# EAGLE design Arm controller Mega (EAGLE 9.4.1)
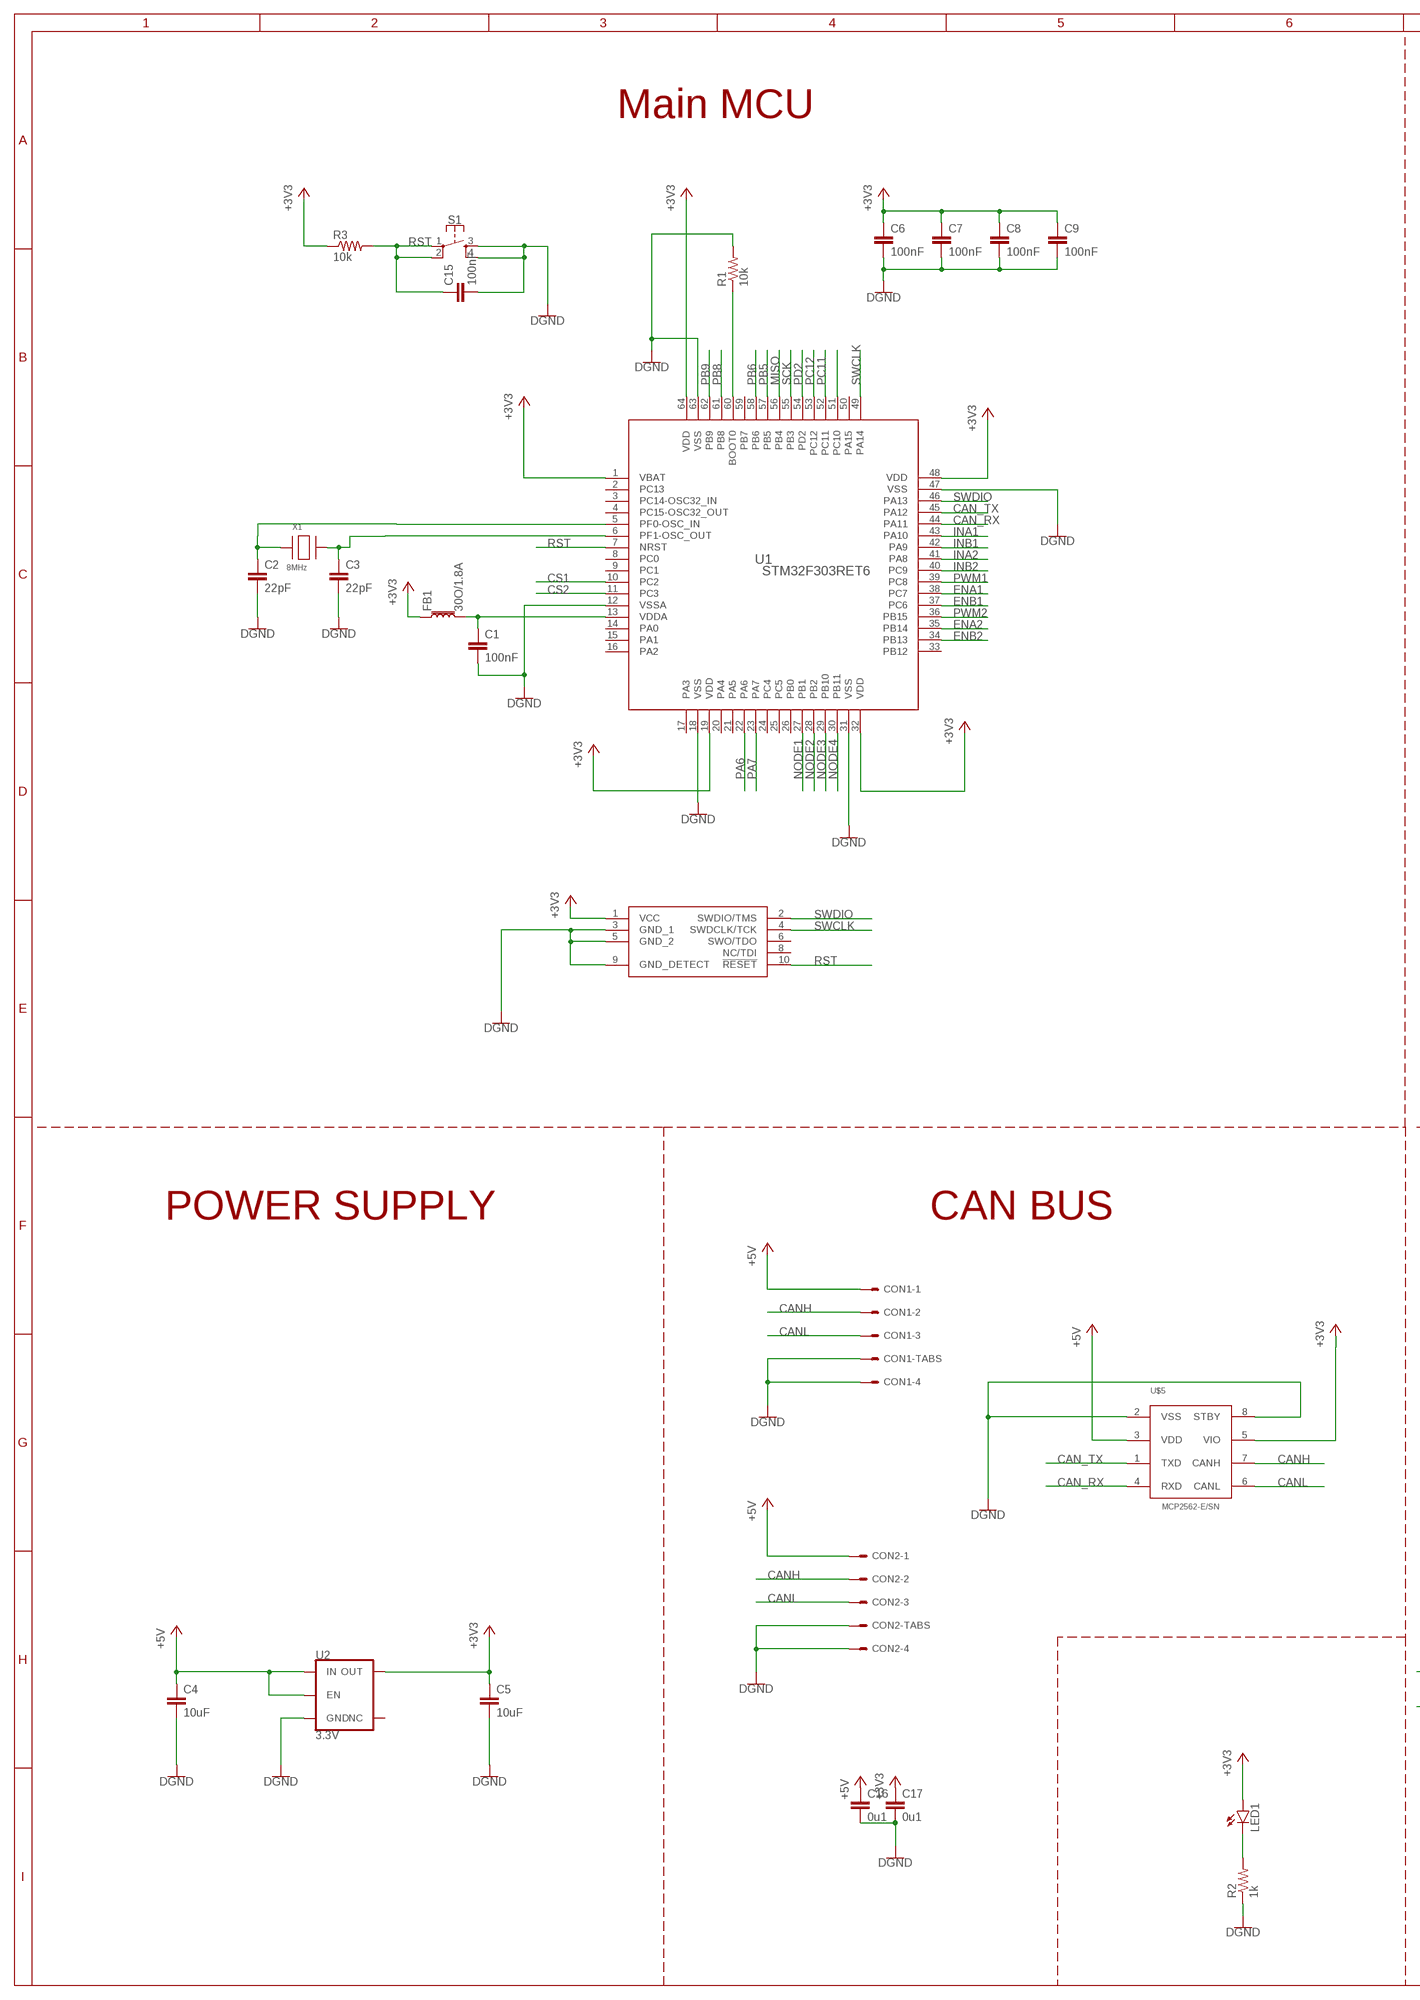
[diagram p0: schematic, sheet 1, part 1 of 2]
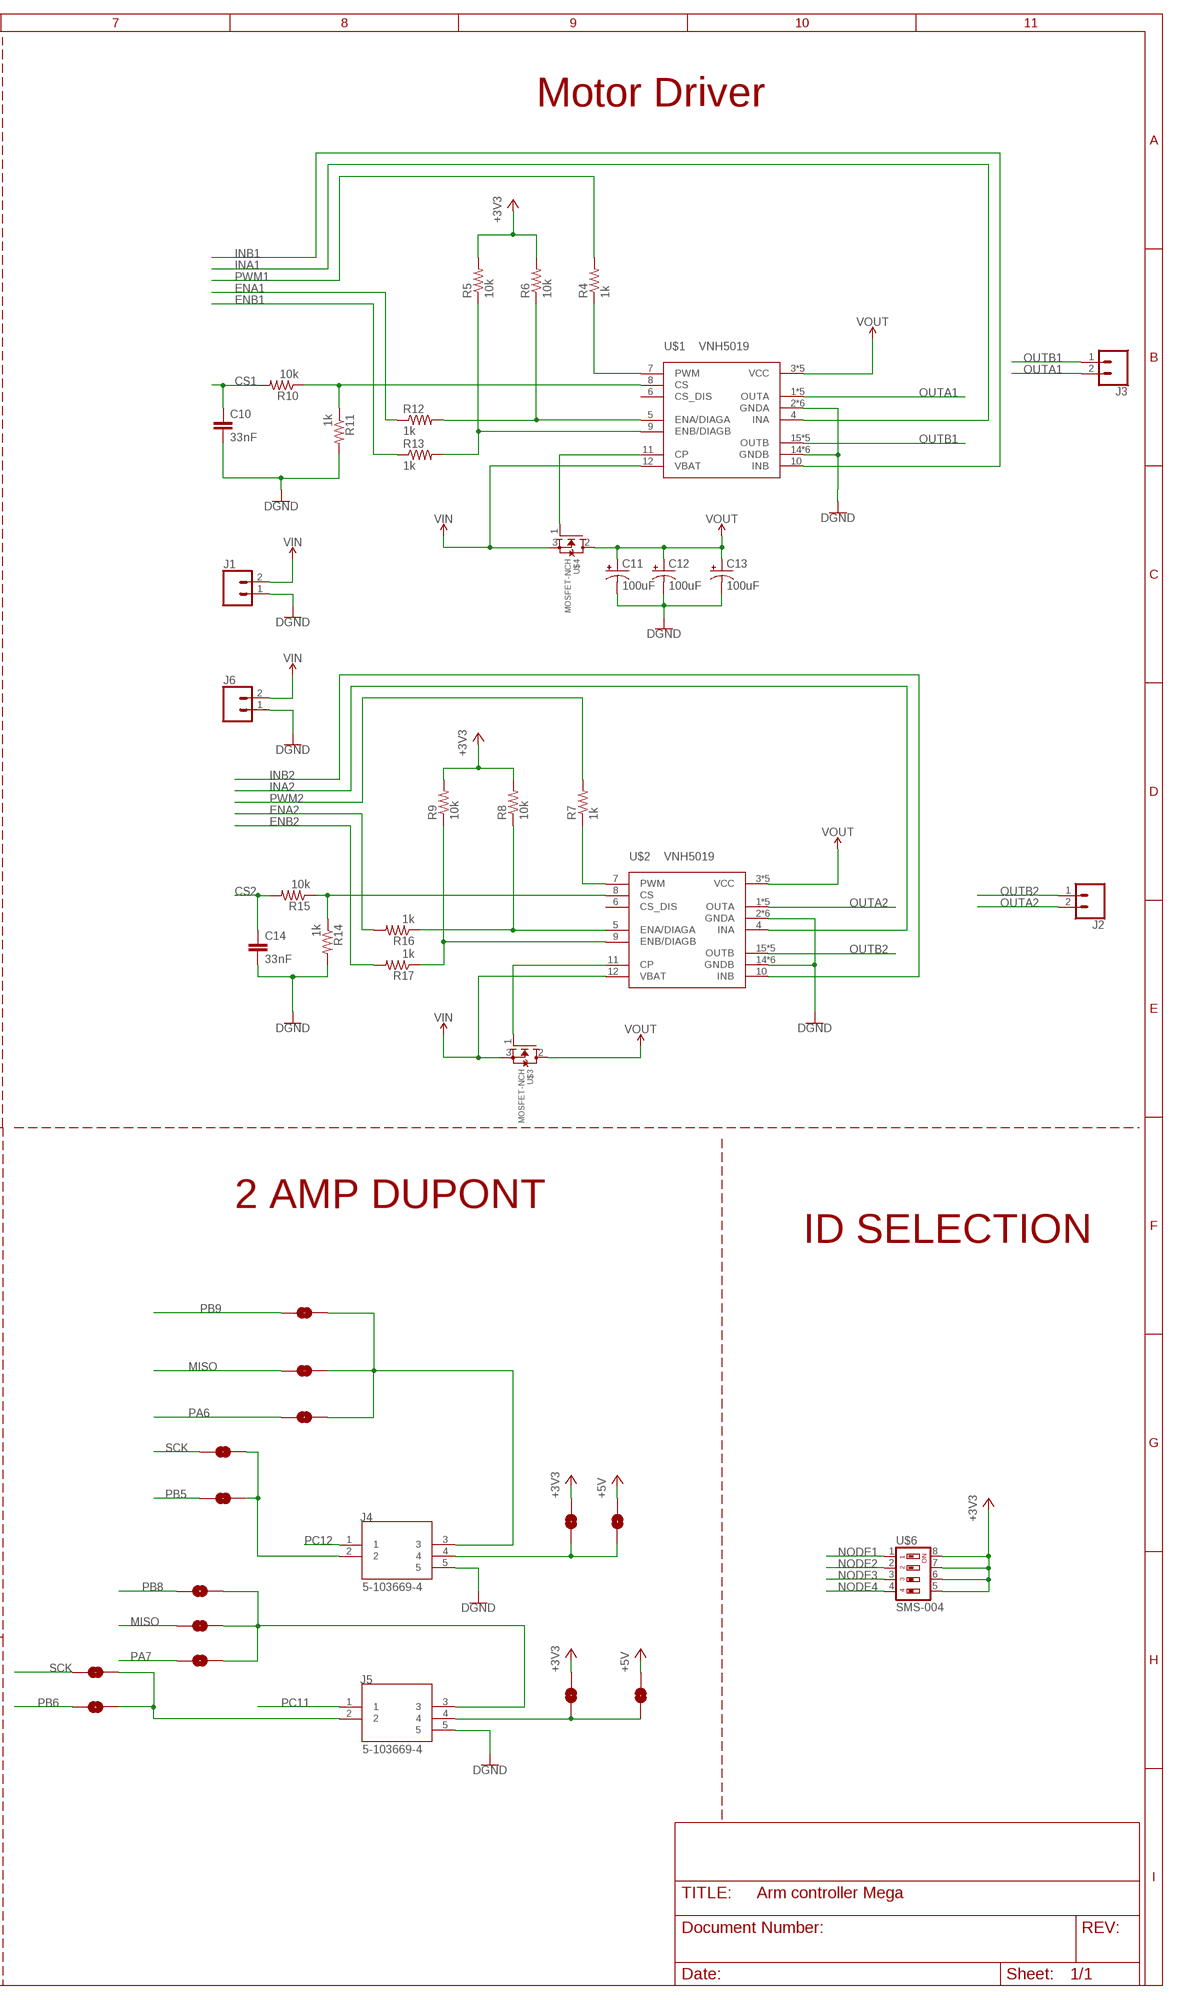
[diagram p1: schematic, sheet 1, part 2 of 2]

## Parts
C1  100nF  C-EUC0805  [C0805]
C2  22pF  C-EUC0805  [C0805]
C3  22pF  C-EUC0805  [C0805]
C4  10uF  C-EUC0805  [C0805]
C5  10uF  C-EUC0805  [C0805]
C6  100nF  C-EUC0805  [C0805]
C7  100nF  C-EUC0805  [C0805]
C8  100nF  C-EUC0805  [C0805]
C9  100nF  C-EUC0805  [C0805]
C10  33nF  C-EUC0805  [C0805]
C11  100uF  CPOL-US153CLV-0810  [153CLV-0810]
C12  100uF  CPOL-US153CLV-0810  [153CLV-0810]
C13  100uF  CPOL-US153CLV-0810  [153CLV-0810]
C14  33nF  C-EUC0805  [C0805]
C15  100nF  C-EUC0805  [C0805]
C16  0u1  C-EUC0805  [C0805]
C17  0u1  C-EUC0805  [C0805]
CON1  SM04B-GHS-TB  [SM04B-GHS-TB]
CON2  SM04B-GHS-TB  [SM04B-GHS-TB]
FB1  30O/1.8A  FERRITE_BEAD-0603  [0603]
J1  CONN_025MM  [SCREWTERMINAL-5MM-2]
J2  CONN_025MM  [SCREWTERMINAL-5MM-2]
J3  CONN_025MM  [SCREWTERMINAL-5MM-2]
J4  5-103669-4  [TE_5-103669-4]
J5  5-103669-4  [TE_5-103669-4]
J6  CONN_025MM  [SCREWTERMINAL-5MM-2]
JP1  CORTEX-M-DBG  [FTSH-105-01-F-DV-007]
JP2  JUMPER-SMT_2_NO_NO-SILK  [SMT-JUMPER_2_NO_NO-SILK]
JP3  JUMPER-SMT_2_NO_NO-SILK  [SMT-JUMPER_2_NO_NO-SILK]
JP4  JUMPER-SMT_2_NO_NO-SILK  [SMT-JUMPER_2_NO_NO-SILK]
JP5  JUMPER-SMT_2_NO_NO-SILK  [SMT-JUMPER_2_NO_NO-SILK]
JP6  JUMPER-SMT_2_NO_NO-SILK  [SMT-JUMPER_2_NO_NO-SILK]
JP7  JUMPER-SMT_2_NO_NO-SILK  [SMT-JUMPER_2_NO_NO-SILK]
JP8  JUMPER-SMT_2_NO_NO-SILK  [SMT-JUMPER_2_NO_NO-SILK]
JP9  JUMPER-SMT_2_NO_NO-SILK  [SMT-JUMPER_2_NO_NO-SILK]
JP10  JUMPER-SMT_2_NO_NO-SILK  [SMT-JUMPER_2_NO_NO-SILK]
JP11  JUMPER-SMT_2_NO_NO-SILK  [SMT-JUMPER_2_NO_NO-SILK]
JP12  JUMPER-SMT_2_NO_NO-SILK  [SMT-JUMPER_2_NO_NO-SILK]
JP13  JUMPER-SMT_2_NO_NO-SILK  [SMT-JUMPER_2_NO_NO-SILK]
JP14  JUMPER-SMT_2_NO_NO-SILK  [SMT-JUMPER_2_NO_NO-SILK]
JP15  JUMPER-SMT_2_NO_NO-SILK  [SMT-JUMPER_2_NO_NO-SILK]
LED1  LEDCHIPLED_0805  [CHIPLED_0805]
R1  10k  R-US_R0805  [R0805]
R2  1k  R-US_R0805  [R0805]
R3  10k  R-US_R0805  [R0805]
R4  1k  R-US_R0805  [R0805]
R5  10k  R-US_R0805  [R0805]
R6  10k  R-US_R0805  [R0805]
R7  1k  R-US_R0805  [R0805]
R8  10k  R-US_R0805  [R0805]
R9  10k  R-US_R0805  [R0805]
R10  10k  R-US_R0805  [R0805]
R11  1k  R-US_R0805  [R0805]
R12  1k  R-US_R0805  [R0805]
R13  1k  R-US_R0805  [R0805]
R14  1k  R-US_R0805  [R0805]
R15  10k  R-US_R0805  [R0805]
R16  1k  R-US_R0805  [R0805]
R17  1k  R-US_R0805  [R0805]
S1  MOMENTARY-SWITCH-SPST-2-SMD-5.2MM  [TACTILE_SWITCH_SMD_5.2MM]
U1  STM32F303RET6  [LQFP64-10X10MM]
U2  3.3V  V_REG_AP2112K-3.3V  [SOT23-5]
U$1  VNH5019  [MULTIPOWERSO-30]
U$2  VNH5019  [MULTIPOWERSO-30]
U$3  MOSFET-NCH  [TO252-3]
U$4  MOSFET-NCH  [TO252-3]
U$5  MCP2562-E/SN  [SOIC8]
U$6  SMS-004  [SMS-004]
X1  8MHz  XTALNX5032  [NX5032]

## Nets
+3V3: C5.1 C6.1 C7.1 C8.1 C9.1 C17.1 FB1.1 JP1.1(VCC) JP2.2 JP4.2 LED1.A R3.1 R5.2 R6.2 R8.2 R9.2 U1.1(VBAT) U1.19(VDD) U1.32(VDD) U1.48(VDD) U1.64(VDD) U2.5(OUT) U$5.5(VIO) U$6.5 U$6.6 U$6.7 U$6.8
+5V: C4.1 C16.1 CON1.P$1 CON2.P$1 JP3.2 JP6.2 U2.1(IN) U2.3(EN) U$5.3(VDD)
CAN_RX: U1.44(PA11) U$5.4(RXD)
CAN_TX: U1.45(PA12) U$5.1(TXD)
CANH: CON1.P$2 CON2.P$2 U$5.7(CANH)
CANL: CON1.P$3 CON2.P$3 U$5.6(CANL)
CS1: C10.1 R10.2 U1.10(PC2)
CS2: C14.1 R15.2 U1.11(PC3)
ENA1: R12.1 U1.38(PC7)
ENA2: R16.2 U1.35(PB14)
ENB1: R13.1 U1.37(PC6)
ENB2: R17.2 U1.34(PB13)
GND: C1.2 C2.2 C3.2 C4.2 C5.2 C6.2 C7.2 C8.2 C9.2 C10.2 C11.- C12.- C13.- C14.2 C15.2 C16.2 C17.2 CON1.P$4 CON1.P$5 CON1.P$6 CON2.P$4 CON2.P$5 CON2.P$6 J1.1 J4.5 J5.5 J6.1 JP1.3(GND_1) JP1.5(GND_2) JP1.9(GND_DETECT) R1.2 R2.1 R11.2 R14.2 S1.3 S1.4 U1.12(VSSA) U1.18(VSS) U1.31(VSS) U1.47(VSS) U1.63(VSS) U2.2(GND) U$1.2(GNDA) U$1.14(GNDB) U$1.17(GNDB) U$1.18(GNDB) U$1.19(GNDB) U$1.20(GNDB) U$1.22(GNDA) U$1.24(GNDB) U$1.26(GNDA) U$1.27(GNDA) U$1.28(GNDA) U$1.29(GNDA) U$2.2(GNDA) U$2.14(GNDB) U$2.17(GNDB) U$2.18(GNDB) U$2.19(GNDB) U$2.20(GNDB) U$2.22(GNDA) U$2.24(GNDB) U$2.26(GNDA) U$2.27(GNDA) U$2.28(GNDA) U$2.29(GNDA) U$5.2(VSS) U$5.8(STBY) ; supply symbol labelled DGND
INA1: U1.43(PA10) U$1.4(INA)
INA2: U1.41(PA8) U$2.4(INA)
INB1: U1.42(PA9) U$1.10(INB)
INB2: U1.40(PC9) U$2.10(INB)
MISO: JP5.2 JP12.2 U1.56(PB4)
N$1: C1.1 FB1.2 U1.13(VDDA)
N$2: C2.1 U1.5(PF0-OSC_IN) X1.P$1
N$3: R1.1 U1.60(BOOT0)
N$4: J5.4 JP2.1 JP3.1
N$6: LED1.C R2.2
N$7: R7.1 U$2.7(PWM)
N$8: R10.1 R11.1 U$1.8(CS)
N$9: R4.1 U$1.7(PWM)
N$10: R6.1 R12.2 U$1.5(ENA/DIAGA)
N$11: R5.1 R13.2 U$1.9(ENB/DIAGB)
N$12: R8.1 R16.1 U$2.5(ENA/DIAGA)
N$13: R9.1 R17.1 U$2.9(ENB/DIAGB)
N$14: R14.1 R15.1 U$2.8(CS)
N$15: U$1.11(CP) U$4.1(G)
N$16: C3.1 U1.6(PF1-OSC_OUT) X1.P$2
N$17: U$2.11(CP) U$3.1(G)
N$18: J4.4 JP4.1 JP6.1
N$19: J4.2 JP9.1 JP10.1
N$21: J4.3 JP5.1 JP7.1 JP8.1
N$23: J5.3 JP11.1 JP12.1 JP13.1
N$24: J5.2 JP14.1 JP15.1
N$28: U1.51(PC10)
NODE1: U1.27(PB1) U$6.1
NODE2: U1.28(PB2) U$6.2
NODE3: U1.29(PB10) U$6.3
NODE4: U1.30(PB11) U$6.4
OUTA1: J3.2 U$1.1(OUTA) U$1.25(OUTA) U$1.30(OUTA) U$1.OUTA U$1.OUTA@1(OUTA)
OUTA2: J2.2 U$2.1(OUTA) U$2.25(OUTA) U$2.30(OUTA) U$2.OUTA U$2.OUTA@1(OUTA)
OUTB1: J3.1 U$1.15(OUTB) U$1.16(OUTB) U$1.21(OUTB) U$1.OUTB U$1.OUTB@1(OUTB)
OUTB2: J2.1 U$2.15(OUTB) U$2.16(OUTB) U$2.21(OUTB) U$2.OUTB U$2.OUTB@1(OUTB)
PA6: JP7.2 U1.22(PA6)
PA7: JP13.2 U1.23(PA7)
PB5: JP9.2 U1.57(PB5)
PB6: JP14.2 U1.58(PB6)
PB8: JP11.2 U1.61(PB8)
PB9: JP8.2 U1.62(PB9)
PC11: J5.1 U1.52(PC11)
PC12: J4.1 U1.53(PC12)
PD2: U1.54(PD2)
PWM1: R4.2 U1.39(PC8)
PWM2: R7.2 U1.36(PB15)
RST: C15.1 JP1.10(!RESET) R3.2 S1.1 S1.2 U1.7(NRST)
SCK: JP10.2 JP15.2 U1.55(PB3)
SWCLK: JP1.4(SWDCLK/TCK) U1.49(PA14)
SWDIO: JP1.2(SWDIO/TMS) U1.46(PA13)
VIN: J1.2 J6.2 U$1.12(VBAT) U$2.12(VBAT) U$3.3(S) U$4.3(S)
VOUT: C11.+ C12.+ C13.+ U$1.3(VCC) U$1.13(VCC) U$1.23(VCC) U$1.VCC U$1.VCC@1(VCC) U$2.3(VCC) U$2.13(VCC) U$2.23(VCC) U$2.VCC U$2.VCC@1(VCC) U$3.2(D) U$4.2(D)
Unconnected: JP1.6(SWO/TDO) JP1.8(NC/TDI) U1.2(PC13) U1.3(PC14-OSC32_IN) U1.4(PC15-OSC32_OUT) U1.8(PC0) U1.9(PC1) U1.14(PA0) U1.15(PA1) U1.16(PA2) U1.17(PA3) U1.20(PA4) U1.21(PA5) U1.24(PC4) U1.25(PC5) U1.26(PB0) U1.33(PB12) U1.50(PA15) U1.59(PB7) U2.4(NC) U$1.6(CS_DIS) U$2.6(CS_DIS)

## Notes on the sheet
- Main MCU | Motor Driver
- POWER SUPPLY | CAN BUS | 2 AMP DUPONT
- ID SELECTION

## Library data of the parts
C1-C10 C14 C15 = rcl:C-EU: CAPACITOR, European symbol; SPICEPREFIX: C
C11-C13 = rcl:CPOL-US: POLARIZED CAPACITOR, American symbol; SPICEPREFIX: C
C16 C17 = resistor:C-EU: CAPACITOR, European symbol
CON1 CON2 = SPEAR:SM04B-GHS-TB
FB1 = SPEAR:FERRITE_BEAD: Ferrite Bead (blocks, cores, rings, chokes, etc.) Inductor with layers of ferrite used to suppress high frequencies. Often used to isolate high frequency noise. SparkFun Products: IOIO-OTG - V2.2 <https://www.sparkfun.com/products/13613> SparkFun SAMD21 Mini Breakout <https://www.sparkfun.com/products/13664> SparkFun 6 Degrees of Freedom Breakout - LSM6DS3 <https://www.sparkfun.com/products/13339> SparkFun SAMD21 Dev Breakout <https://www.sparkfun.com/products/13672>; PROD_ID: NDUC-13805
J1-J3 J6 = SparkFun-Connectors:CONN_02: Multi connection point. Often used as Generic Header-pin footprint for 0.1 inch spaced/style header connections On any of the 0.1 inch spaced packages, you can populate with these: Break Away Headers - Straight <https://www.sparkfun.com/products/116> (PRT-00116) Break Away Male Headers - Right Angle <https://www.sparkfun.com/products/553> (PRT-00553) Female Headers <https://www.sparkfun.com/products/115> (PRT-00115) Break Away Headers - Machine Pin <https://www.sparkfun.com/products/117> (PRT-00117) Break Away Female Headers - Swiss Machine Pin <https://www.sparkfun.com/products/743> (PRT-00743) For SCREWTERMINALS and SPRING TERMINALS visit here: Screw Terimnals on SparkFun.com <https://www.sparkfun.com/search/results?term=Screw+Terminals> (5mm/3.5mm/2.54mm spacing) This device is also useful as a general connection point to wire up your design to another part of your project. Our various solder wires solder well into these plated through hole pads. Hook-Up Wire - Assortment (Stranded, 22 AWG) <https://www.sparkfun.com/products/11375> (PRT-11375) Hook-Up Wire - Assortment (Solid Core, 22 AWG) <https://www.sparkfun.com/products/11367> (PRT-11367) View the entire wire category on our website here <https://www.sparkfun.com/categories/141> Special notes: Molex polarized connector foot print use with: PRT-08233 with associated crimp pins and housings. 2.54_SCREWTERM for use with PRT-10571. 3.5mm Screw Terminal footprints for PRT-08084 5mm Screw Terminal footprints for use with PRT-08432; SF_SKU: PRT-08432
J4 J5 = SPEAR:5-103669-4: 05 MTE HDR SRST LATCH W/HLDWN; AVAILABILITY: Unavailable; CENTERLINE_PITCH: 2.54 mm[.1 in]; COMMENT: 5-103669-4; DESCRIPTION: 05 MTE HDR SRST LATCH W/HLDWN; EU_ROHS_COMPLIANCE: Compliant; LINK: http://www.te.com/usa-en/product-5-103669-4.html; MF: TE Connectivity; MP: 5-103669-4; NUMBER_OF_POSITIONS: 5; PACKAGE: None; PRICE: None; PRODUCT_TYPE: Connector
JP1 = SPEAR:CORTEX-M-DBG: Cortex-M Debug Header Standard debug/programming header used for programming Cortex parts. Does not include shroud but does have key pin removed.
JP2-JP15 = SparkFun-Jumpers:JUMPER-SMT_2_NO: Normally open jumper This jumper has two pads in close proximity to each other. Apply solder to close the connection. Round pads are easier to solder for beginners, but are a lot larger. SparkFun Product that uses the round pads: SparkFun EL Sequencer <https://www.sparkfun.com/products/12781>
LED1 = led:LED: LED OSRAM: - CHIPLED LG R971, LG N971, LY N971, LG Q971, LY Q971, LO R971, LY R971 LH N974, LH R974 LS Q976, LO Q976, LY Q976 LO Q996 - Hyper CHIPLED LW Q18S LB Q993, LB Q99A, LB R99A - SideLED LS A670, LO A670, LY A670, LG A670, LP A670 LB A673, LV A673, LT A673, LW A673 LH A674 LY A675 LS A676, LA A676, LO A676, LY A676, LW A676 LS A679, LY A679, LG A679 - Hyper Micro SIDELED® LS Y876, LA Y876, LO Y876, LY Y876 LT Y87S - SmartLED LW L88C, LW L88S LB L89C, LB L89S, LG L890 LS L89K, LO L89K, LY L89K LS L896, LA L896, LO L896, LY L896 - TOPLED LS T670, LO T670, LY T670, LG T670, LP T670 LSG T670, LSP T670, LSY T670, LOP T670, LYG T670 LG T671, LOG T671, LSG T671 LB T673, LV T673, LT T673, LW T673 LH T674 LS T676, LA T676, LO T676, LY T676, LB T676, LH T676, LSB T676, LW T676 LB T67C, LV T67C, LT T67C, LS T67K, LO T67K, LY T67K, LW E67C LS E67B, LA E67B, LO E67B, LY E67B, LB E67C, LV E67C, LT E67C LW T67C LS T679, LY T679, LG T679 LS T770, LO T770, LY T770, LG T770, LP T770 LB T773, LV T773, LT T773, LW T773 LH T774 LS E675, LA E675, LY E675, LS T675 LS T776, LA T776, LO T776, LY T776, LB T776 LHGB T686 LT T68C, LB T68C - Hyper Mini TOPLED® LB M676 - Mini TOPLED Santana® LG M470 LS M47K, LO M47K, LY M47K Source: http://www.osram.convergy.de LUXEON: - LUMILED® LXK2-PW12-R00, LXK2-PW12-S00, LXK2-PW14-U00, LXK2-PW14-V00 LXK2-PM12-R00, LXK2-PM12-S00, LXK2-PM14-U00 LXK2-PE12-Q00, LXK2-PE12-R00, LXK2-PE12-S00, LXK2-PE14-T00, LXK2-PE14-U00 LXK2-PB12-K00, LXK2-PB12-L00, LXK2-PB12-M00, LXK2-PB14-N00, LXK2-PB14-P00, LXK2-PB14-Q00 LXK2-PR12-L00, LXK2-PR12-M00, LXK2-PR14-Q00, LXK2-PR14-R00 LXK2-PD12-Q00, LXK2-PD12-R00, LXK2-PD12-S00 LXK2-PH12-R00, LXK2-PH12-S00 LXK2-PL12-P00, LXK2-PL12-Q00, LXK2-PL12-R00 Source: www.luxeon.com KINGBRIGHT: KA-3528ASYC Source: www.kingbright.com
R1-R17 = rcl:R-US_: RESISTOR, American symbol; SPICEPREFIX: R
S1 = SPEAR:MOMENTARY-SWITCH-SPST-2: Momentary Switch (Pushbutton) - SPST - Two Circuits Normally-open (NO) SPST momentary switches (buttons, pushbuttons). Schematic symbol includes two switch circuits. Variants SMD-4.6MMX2.8MM - 4.60mm x 2.80mm Tactile Momentary Button Switch - Used on SparkFun SAMD21 Mini Breakout <https://www.sparkfun.com/products/13664> SMD-5.2MM - Mini Pushbutton Switch - SMD <https://www.sparkfun.com/products/8720> - Used on Arduino Pro Mini <https://www.sparkfun.com/products/11114>; PROD_ID: SWCH-08247; SF_SKU: COM-08720
U1 = SPEAR:STM32F303RET6; MANUFACTURER_PART_NUMBER: stm32f302_303r2; VENDOR: STMicroelectronics
U2 = SparkFun-IC-Power:V_REG_AP2112: AP2112 - 600mA CMOS LDO Regulator w/ Enable The AP2112 is CMOS process low dropout linear regulator with enable function, the regulator delivers a guaranteed 600mA (min.) continuous load current. Features Output Voltage Accuracy: ±1.5% Output Current: 600mA (Min.) Foldback Short Current Protection: 50mA Enable Function to Turn ON/OFF VOUT Low Dropout Voltage (3.3V): 250mV (Typ.) @IOUT=600mA Excellent Load Regulation: 0.2%/A (Typ.) Excellent Line Regulation: 0.02%/V (Typ.) Low Quiescent Current: 55μA (Typ.) Low Standby Current: 0.01μA (Typ.) Low Output Noise: 50μVRMS PSRR: 100Hz -65dB, 1kHz -65dB OTSD Protection Stable with 1.0μF Flexible Cap: Ceramic, Tantalum and Aluminum Electrolytic Operation Temperature Range: -40°C to 85°C ESD: MM 400V, HBM 4000V; PROD_ID: VREG-12457
U$1 U$2 = SPEAR:VNH5019: The VHN5019A-E is a full bridge motor driver intended for a wide range of automotive applications. The device incorporates a dual monolithic high-side drivers and two low-side switches. The high-side driver switch is designed using STMicroelectronics’ well known and proven proprietary VIPower® M0 technology that allows to efficiently integrate on the same die a true Power MOSFET with an intelligent signal/protection circuit.
U$3 U$4 = SPEAR:MOSFET-NCH: N-Channel MOSFET like the IPB80N03S4L-03.
U$5 = SPEAR:MCP2562-E/SN
U$6 = SPEAR:SMS-004
X1 = adafruit:XTAL: Low cost SMT crystals, no capacitors included http://www.ladyada.net/library/eagle

## Board
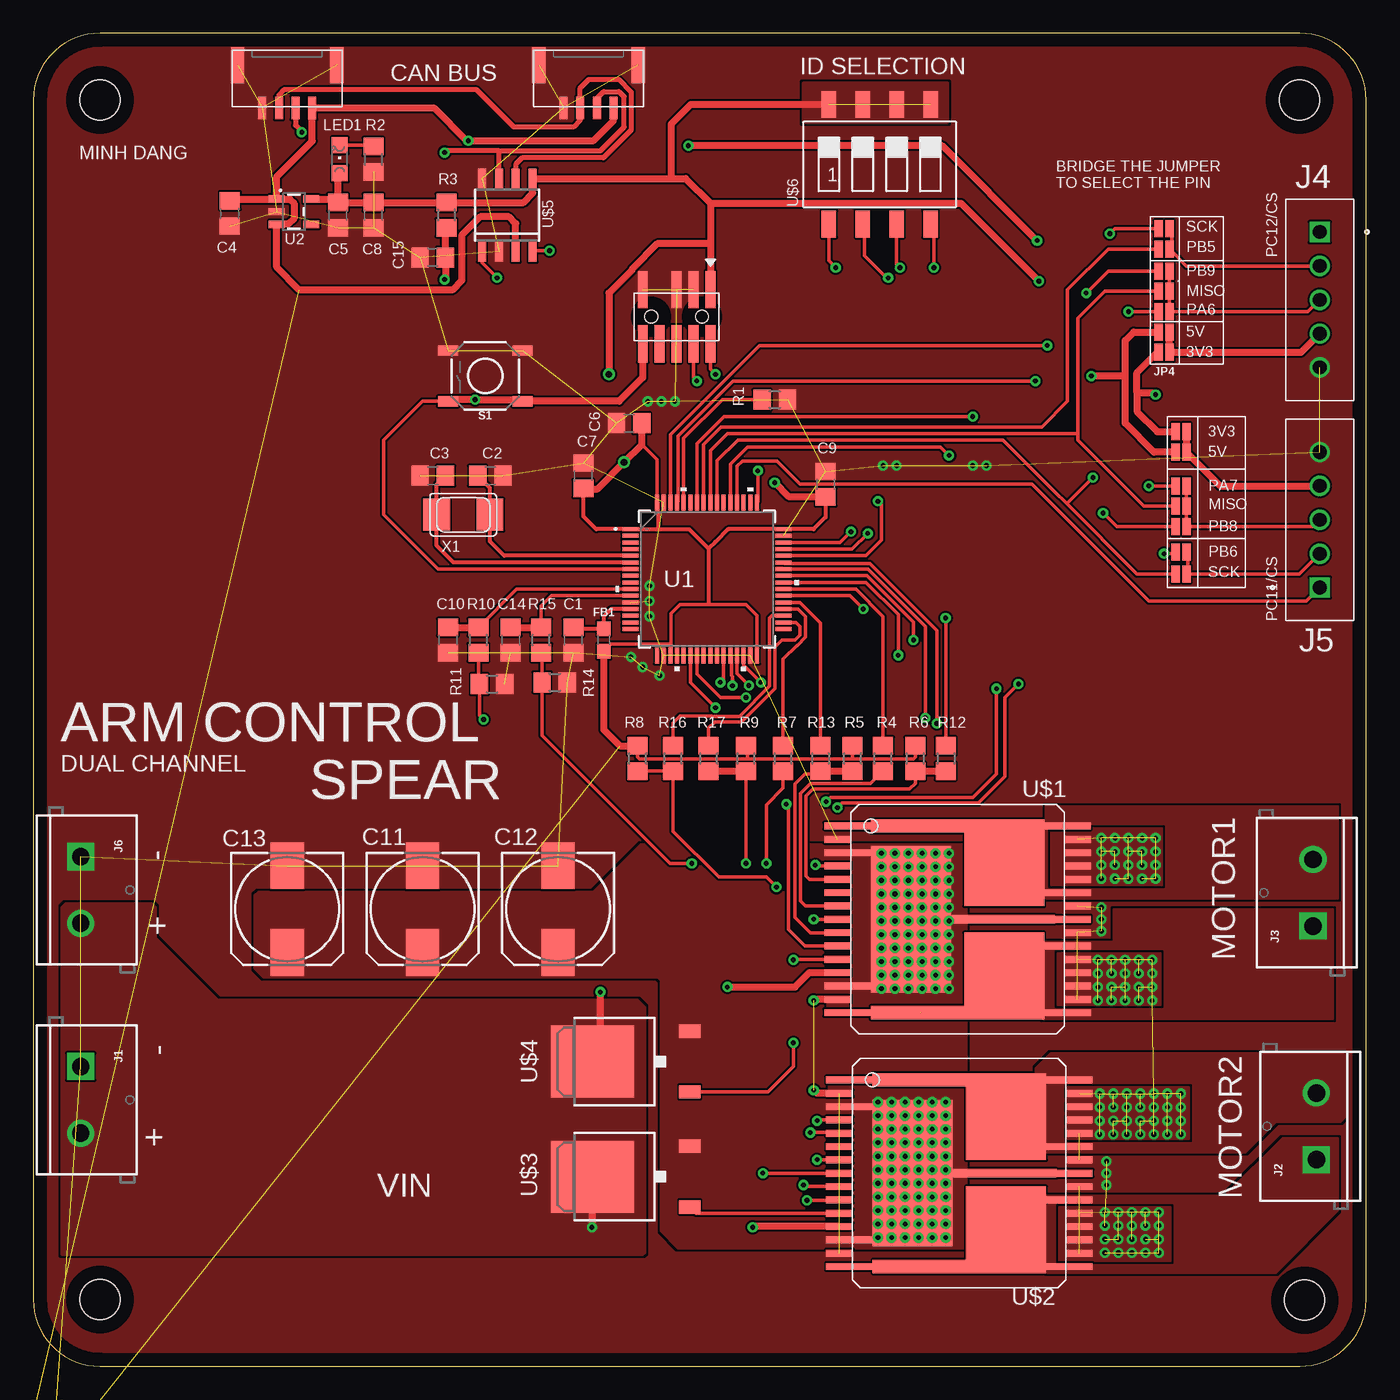
[diagram p2: board, top side]
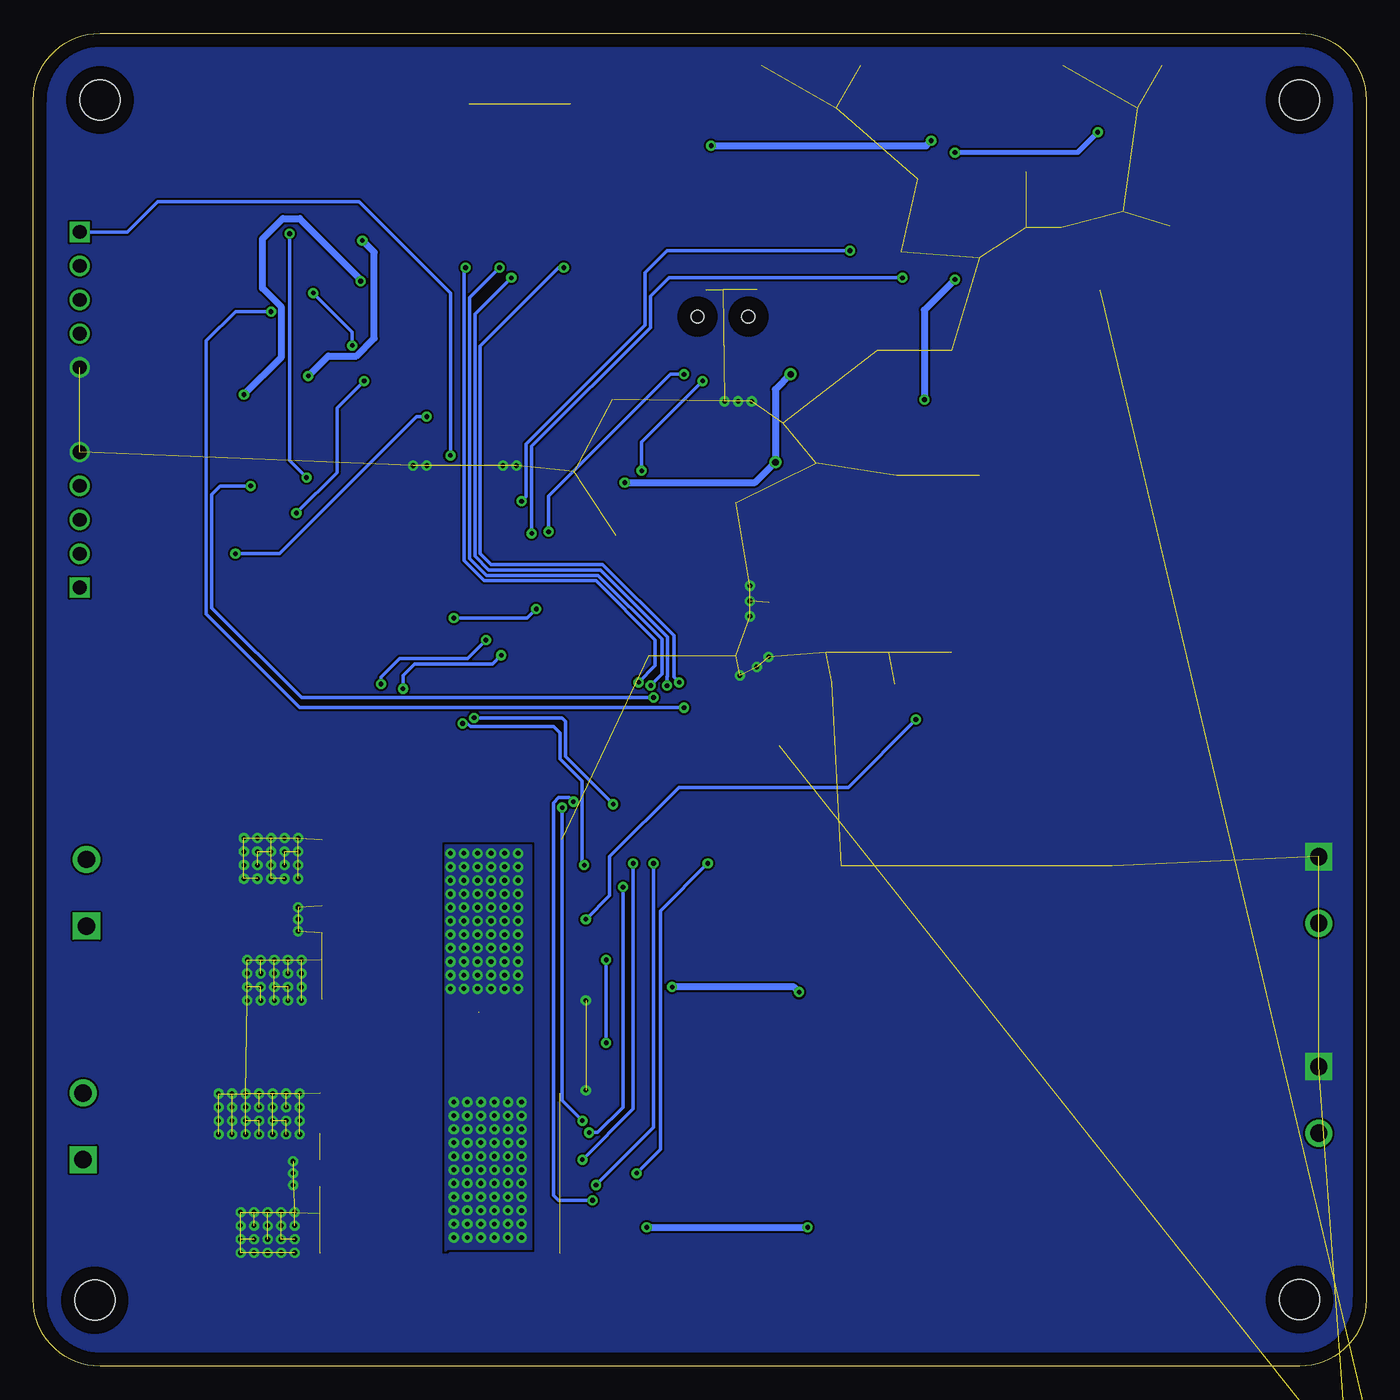
[diagram p3: board, bottom side, seen from below]

Size 100 x 100 mm. Coordinates in mm from the lower left corner, seen from the top.
Outline: 5,0 95,0 arc90 100,5 100,95 arc90 95,100 5,100 arc90 0,95 0,5 arc90 5,0
Copper layers (1*16): Top 0.035mm / dielectric 1.5mm / Bottom 0.035mm
Design rules "default *": minimum track width 6mil, minimum drill 0.35mm, track to track 6mil, track to pad 6mil, pad to pad 6mil, via to via 6mil, smd to smd 6mil, copper to edge 40mil, drill to drill 6mil, minimum pad ring 10mil, minimum via ring 8mil, stop-mask expansion 4mil, vias tented up to drill 15mil, thermal gap 10mil
Holes 3 mm at 5,5 95,95 5,95 95.38,4.96

### Footprints (pad centres in the part's own frame; a part is rotated, then mirrored left to right if it is on the bottom)
C0805 = smd 1.3 x 1.5: 1 -0.95,0; 2 0.95,0
153CLV-0810 = smd 3.5 x 2.5: + 3.25,0; - -3.25,0
SM04B-GHS-TB = smd 0.6 x 1.7: P$1 -1.875,0.85; P$2 -0.625,0.85; P$3 0.625,0.85; P$4 1.875,0.85 | smd 1 x 2.7: P$5 -3.725,-2.35; P$6 3.725,-2.35
0603 = smd 1.1 x 1: 1 -0.85,0; 2 0.85,0
SCREWTERMINAL-5MM-2 = drill 1.3 pad 2.032 square: 1 0,0 | drill 1.3 pad 2.032: 2 5,0
TE_5-103669-4 = drill 1.02 square: 1 -5.08,0 | drill 1.02: 2 -2.54,0; 3 0,0; 4 2.54,0; 5 5.08,0
FTSH-105-01-F-DV-007 = smd 0.737 x 2.794: 1 -2.54,-2.032; 2 -2.54,2.032; 3 -1.27,-2.032; 4 -1.27,2.032; 5 0,-2.032; 6 0,2.032; 8 1.27,2.032; 9 2.54,-2.032; 10 2.54,2.032 | hole 0.965: -1.905,0; 1.905,0
SMT-JUMPER_2_NO_NO-SILK = smd 0.635 x 1.27: 1 -0.406,0; 2 0.406,0
CHIPLED_0805 = smd 1.2 x 1.2: A 0,-1.05; C 0,1.05
R0805 = smd 1.3 x 1.5: 1 -0.95,0; 2 0.95,0
TACTILE_SWITCH_SMD_5.2MM = smd 1.524 x 0.762: 1 -2.794,1.905; 2 2.794,1.905; 3 -2.794,-1.905; 4 2.794,-1.905
LQFP64-10X10MM = smd 1.194 x 0.305: 1 -5.75,3.75; 2 -5.75,3.25; 3 -5.75,2.75; 4 -5.75,2.25; 5 -5.75,1.75; 6 -5.75,1.25; 7 -5.75,0.75; 8 -5.75,0.25; 9 -5.75,-0.25; 10 -5.75,-0.75; 11 -5.75,-1.25; 12 -5.75,-1.75; 13 -5.75,-2.25; 14 -5.75,-2.75; 15 -5.75,-3.25; 16 -5.75,-3.75; 33 5.75,-3.75; 34 5.75,-3.25; 35 5.75,-2.75; 36 5.75,-2.25; 37 5.75,-1.75; 38 5.75,-1.25; 39 5.75,-0.75; 40 5.75,-0.25; 41 5.75,0.25; 42 5.75,0.75; 43 5.75,1.25; 44 5.75,1.75; 45 5.75,2.25; 46 5.75,2.75; 47 5.75,3.25; 48 5.75,3.75 | smd 0.305 x 1.194: 17 -3.75,-5.75; 18 -3.25,-5.75; 19 -2.75,-5.75; 20 -2.25,-5.75; 21 -1.75,-5.75; 22 -1.25,-5.75; 23 -0.75,-5.75; 24 -0.25,-5.75; 25 0.25,-5.75; 26 0.75,-5.75; 27 1.25,-5.75; 28 1.75,-5.75; 29 2.25,-5.75; 30 2.75,-5.75; 31 3.25,-5.75; 32 3.75,-5.75; 49 3.75,5.75; 50 3.25,5.75; 51 2.75,5.75; 52 2.25,5.75; 53 1.75,5.75; 54 1.25,5.75; 55 0.75,5.75; 56 0.25,5.75; 57 -0.25,5.75; 58 -0.75,5.75; 59 -1.25,5.75; 60 -1.75,5.75; 61 -2.25,5.75; 62 -2.75,5.75; 63 -3.25,5.75; 64 -3.75,5.75
SOT23-5 = smd 0.55 x 1.2: 1 -0.95,-1.3; 2 0,-1.3; 3 0.95,-1.3; 4 0.95,1.3; 5 -0.95,1.3
MULTIPOWERSO-30 = smd 0.508 x 12: 1 -7,-4; 15 7,-4; 16 7,4; 30 -7,4 | smd 0.508 x 2: 2 -6,-9; 4 -4,-9; 5 -3,-9; 6 -2,-9; 7 -1,-9; 8 0,-9; 9 1,-9; 10 2,-9; 11 3,-9; 12 4,-9; 14 6,-9; 17 6,9; 18 5,9; 19 4,9; 20 3,9; 22 1,9; 24 -1,9; 26 -3,9; 27 -4,9; 28 -5,9; 29 -6,9 | smd 0.508 x 4: 3 -5,-8; 13 5,-8; 21 2,8; 23 0,8; 25 -2,8 | smd 6.5 x 6: OUTA -4.25,3.5; OUTB 4.25,3.5 | smd 1 x 7.5: OUTA@1 -7,-2.755; OUTB@1 7,-2.755 | smd 11 x 6: VCC 0,-3.5 | smd 0.65 x 8.3: VCC@1 0,3.145
TO252-3 = smd 1 x 1.6: 1 -2.28,-6.07; 2 2.28,-6.07 | smd 5.4 x 6.2: 3 0,1.23
SOIC8 = smd 0.6 x 1.5: 1 -1.905,-2.75; 2 -0.635,-2.75; 3 0.635,-2.75; 4 1.905,-2.75; 5 1.905,2.75; 6 0.635,2.75; 7 -0.635,2.75; 8 -1.905,2.75
SMS-004 = smd 1.092 x 2.007: 1 -3.81,-4.496; 2 -1.27,-4.496; 3 1.27,-4.496; 4 3.81,-4.496; 5 3.81,4.496; 6 1.27,4.496; 7 -1.27,4.496; 8 -3.81,4.496
NX5032 = smd 2 x 2.4: P$1 2,0; P$2 -2,0

### Placement (x,y rotation side)
C1  40.51,54.48 270 top
C2  34.29,66.8 0 top
C3  29.97,66.8 180 top
C4  14.73,86.49 270 top
C5  22.86,86.36 270 top
C6  44.7,70.74 180 top
C7  41.27,66.8 90 top
C8  25.53,86.36 270 top
C9  59.44,66.17 90 top
C10  31.11,54.48 270 top
C11  29.21,34.29 270 top
C12  39.37,34.29 270 top
C13  19.05,34.29 270 top
C14  35.81,54.48 270 top
C15  29.97,83.19 180 top
C16  0.6,-5.1 0 top  (outside the outline)
C17  0.6,-9.3 0 top  (outside the outline)
CON1  41.66,95.25 180 top
CON2  19.05,95.25 180 top
FB1  42.8,54.48 90 top
J1  3.56,22.48 270 top
J2  96.27,15.49 90 top
J3  96.01,33.02 90 top
J4  96.52,80.01 270 top
J5  96.52,63.5 90 top
J6  3.56,38.23 270 top
JP1  48.26,78.74 180 top
JP2  86.11,70.1 180 top
JP3  86.11,68.58 180 top
JP4  84.84,76.07 180 top
JP5  84.84,80.64 180 top
JP6  84.84,77.6 180 top
JP7  84.84,79.12 180 top
JP8  84.84,82.17 180 top
JP9  84.84,83.82 180 top
JP10  84.84,85.34 180 top
JP11  86.11,62.99 180 top
JP12  86.11,64.52 180 top
JP13  86.11,66.04 180 top
JP14  86.11,61.09 180 top
JP15  86.11,59.44 180 top
LED1  22.99,90.55 0 top
R1  55.63,72.52 0 top
R2  25.53,90.55 90 top
R3  30.99,86.36 270 top
R4  63.75,45.59 90 top
R5  61.47,45.59 90 top
R6  66.17,45.59 90 top
R7  56.26,45.59 90 top
R8  45.34,45.59 90 top
R9  53.47,45.59 90 top
R10  33.4,54.48 90 top
R11  34.42,51.18 0 top
R12  68.45,45.59 270 top
R13  59.05,45.59 270 top
R14  39.12,51.31 0 top
R15  38.1,54.48 90 top
R16  48.01,45.59 90 top
R17  50.67,45.59 90 top
S1  33.91,74.3 180 top
U1  50.55,59.05 0 top
U2  19.56,86.61 270 top
U$1  69.34,33.53 270 top
U$2  69.47,14.48 270 top
U$3  43.18,14.22 90 top
U$4  43.18,22.86 90 top
U$5  35.56,86.36 0 top
U$6  63.5,90.17 0 top
X1  32.26,63.88 0 top

### Tracks (layer width: path | path; a pad name or v marks a point on that pad's centre or on a via)
+3V3  (via drill 0.35, 0.5)  (4 unrouted)
  Top 0.254: 45.65,69.15 46.8,68.01 U1.64 | 47.83,54.18 47.83,56.47 48.51,57.15 50.67,57.15 53.47,57.15 54.3,56.32 U1.32 | 47.83,54.18 47.83,53.34 U1.19 | 47.83,54.18 47.56,54.18 43.35,54.18 FB1.1 | R6.2 66.17,45.72 66.02,45.57 61.47,45.57 | R8.2 45.34,45.72 45.49,45.57 53.59,45.57 | 61.47,45.57 53.59,45.57 | R9.2 53.59,46.42 53.59,45.57 | R5.2 61.47,45.57
  Top 0.305: C9.1 59.44,63.69 58.55,62.8 U1.48 52.14,62.8 51.18,61.85 50.67,61.34 | C7.1 41.27,65.79 41.27,63.75 42.22,62.8 U1.1 46.86,62.8 | 50.67,61.34 50.67,57.15 | 46.86,62.8 49.21,62.8 50.67,61.34 | U1.64 46.84,64.76 46.84,64.08 46.86,64.06 46.86,62.8
  Top 0.508: U2.5 22.61,87.56 C5.1 | C5.1 25.27,87.31 C8.1 R3.1 36.76,87.31 37.47,88.01 U$5.5 47.88,89.11 | 47.88,89.11 48.94,89.11 50.8,87.25 | 50.8,87.25 50.8,84.2 | 50.8,84.2 JP1.1 | C5.1 22.86,89.37 LED1.A | 50.8,84.2 46.81,84.2 44.95,82.34 44.95,82.28 43.18,80.52 v43.18,74.42 | C6.1 45.65,69.15 v44.32,67.82 42.29,65.79 41.27,65.79 | C9.1 56.7,65.22 v55.63,66.29 | 82.8,73.03 82.8,74.55 84.33,76.07 JP4.2 | 82.8,73.03 82.8,71.63 84.33,70.1 JP2.2 | 50.8,87.25 69.6,87.25 v75.44,81.41 | 82.8,73.03 84.07,73.03 v84.2,72.9 | 47.88,89.11 47.88,93.22 49.33,94.67 U$6.8 | FB1.1 42.8,47.75 44.01,46.54 R8.2
  Bottom 0.508: v43.18,74.42 44.32,73.28 v44.32,67.82 45.85,66.29 v55.63,66.29 | v84.2,72.9 81.38,75.72 81.38,79.45 82.8,80.87 82.8,84.58 81.28,86.11 80.01,86.11 75.44,81.53 v75.44,81.41
  pour Top (rank 2, no thermals): 57.78,93.34 68.58,93.34 68.58,96.27 57.78,96.27
+5V  (via drill 0.35)  (1 unrouted)
  Top 0.508: C4.1 14.86,87.56 U2.1 | U2.1 19.24,87.56 19.56,87.25 19.56,86.11 19.12,85.66 U2.3 18.26,82.45 19.96,80.75 31.44,80.75 32.14,81.45 32.14,84.85 33.53,86.23 35.69,86.23 36.2,85.72 U$5.3 | U2.1 18.26,89.25 20.93,91.92 CON2.P$1 30.06,94.4 32.51,91.95 v32.64,91.95 42.04,91.95 43.53,93.44 CON1.P$1 | JP3.2 84.07,68.58 81.92,70.74 81.92,74.3 | JP6.2 82.55,77.6 81.92,76.96 81.92,74.3 | 81.92,74.3 v79.38,74.3 | v75.31,84.45 68.2,91.57 v49.15,91.57
  Bottom 0.508: v79.38,74.3 77.87,75.8 75.75,75.8 74.42,77.12 74.42,83.57 v75.31,84.45 | v49.15,91.57 33.02,91.57 v32.64,91.95
CAN_RX  (via drill 0.35)
  Top 0.254: U1.44 62.46,60.8 63.63,61.98 63.63,64.64 v63.37,64.9 | v38.73,83.69 37.55,83.69 U$5.4
  Bottom 0.254: v38.73,83.69 52.45,83.69 54.1,82.04 54.1,78.11 63.02,69.19 63.02,65.25 v63.37,64.9
CAN_TX  (via drill 0.35)
  Top 0.254: U$5.1 33.66,82.8 v34.8,81.66 | v62.61,62.48 61.43,61.3 U1.45
  Bottom 0.254: v34.8,81.66 52.32,81.66 53.7,80.29 53.7,77.94 62.61,69.02 v62.61,62.48
CANH  (via drill 0.35)
  Top 0.381: U$5.7 34.92,90.93 34.92,91.19 | 34.92,91.19 42.55,91.19 44.32,92.96 44.32,95.25 43.94,95.63 42.8,95.63 42.28,95.11 CON1.P$2 | CON2.P$2 19.68,93.1 20.14,92.64 v20.14,92.58 | 34.92,91.19 30.99,91.19 v30.86,91.06
  Bottom 0.381: v20.14,92.58 21.66,91.06 v30.86,91.06
CANL
  Top 0.381: U$5.6 36.2,90.17 36.68,90.65 42.77,90.65 44.86,92.74 44.86,95.6 43.91,96.55 41.68,96.55 41.03,95.89 CON1.P$3 41.03,93.48 40.51,92.96 36.07,92.96 33.27,95.76 18.8,95.76 18.43,95.39 CON2.P$3
CS1
  Top 0.254: R10.2 36.27,58.3 U1.10
  Top 0.508: C10.1 R10.2
CS2
  Top 0.254: U1.11 38.88,57.8 38.1,57.02 R15.2
  Top 0.508: C14.1 R15.2
ENA1  (via drill 0.35)
  Top 0.254: U1.38 61.28,57.8 v62.27,56.81 | v68.45,56.13 R12.1
  Bottom 0.254: v62.27,56.81 62.95,56.13 v68.45,56.13
ENA2
  Top 0.254: U1.35 55.42,56.3 55.24,56.13 55.24,51.01 52.98,48.74 50.91,48.74 50.89,48.77 48.51,48.77 48.01,48.26 R16.2
ENB1
  Top 0.254: R13.1 59.05,55.75 57.5,57.3 U1.37
ENB2
  Top 0.254: R17.2 50.67,47.88 51.13,48.34 53.15,48.34 55.65,50.84 55.65,53.98 56.16,54.48 57.15,54.48 57.53,54.86 57.53,55.5 57.23,55.8 U1.34
GND  (via drill 0.35)  (164 unrouted)
  Top 0.508: U$1.14 58.64,27.53 v58.55,27.43 | U$2.2 58.77,20.48 v58.55,20.7
  other vias: 63.75,67.56 64.77,67.56 70.48,67.56 71.5,67.56 46.23,58.55 46.23,57.4 46.23,56.26 44.83,53.21 45.72,52.45 46.99,51.82 46.1,72.39 47.12,72.39 48.13,72.39 80.14,39.62 80.14,38.61 80.14,37.59 80.14,36.58 81.15,39.62 81.15,38.61 81.15,37.59 81.15,36.58 82.17,39.62 82.17,38.61 82.17,37.59 82.17,36.58 83.19,39.62 83.19,38.61 83.19,37.59 83.19,36.58 84.2,36.58 84.2,37.59 84.2,38.61 84.2,39.62 79.88,30.48 80.9,30.48 81.92,30.48 82.93,30.48 83.95,30.48 79.88,29.46 80.9,29.46 81.92,29.46 82.93,29.46 83.95,29.46 83.95,28.45 82.93,28.45 81.92,28.45 80.9,28.45 79.88,28.45 79.88,27.43 80.9,27.43 81.92,27.43 82.93,27.43 83.95,27.43 80.01,20.45 81.03,20.45 82.04,20.45 83.06,20.45 84.07,20.45 85.09,20.45 86.11,20.45 86.11,19.43 85.09,19.43 84.07,19.43 83.06,19.43 82.04,19.43 81.03,19.43 80.01,19.43 80.01,18.41 81.03,18.41 82.04,18.41 83.06,18.41 84.07,18.41 85.09,18.41 86.11,18.41 86.11,17.4 85.09,17.4 84.07,17.4 83.06,17.4 82.04,17.4 81.03,17.4 80.01,17.4 80.39,11.56 81.41,11.56 82.42,11.56 83.44,11.56 84.45,11.56 84.45,10.54 84.45,9.53 84.45,8.51 83.44,10.54 83.44,9.53 83.44,8.51 82.42,8.51 82.42,9.53 82.42,10.54 81.41,10.54 81.41,9.53 81.41,8.51 80.39,8.51 80.39,9.53 80.39,10.54 80.14,34.42 80.14,33.53 80.14,32.64 80.52,15.37 80.52,14.48 80.52,13.59
  pour Top (no thermals): 76.33,40.39 76.33,36.07 84.71,36.07 84.71,40.39
  pour Top (rank 6, no thermals): -0.51,101.22 100.58,101.22 100.58,-1.27 -0.51,-1.27
  pour Bottom (rank 6, no thermals): -1.4,101.85 -1.4,-1.91 100.97,-1.91 100.97,101.85
  pour Top: 77.34,39.75 77.34,36.07 84.71,36.07 84.71,40.13 77.34,40.13
  pour Top (no thermals): 76.83,30.99 76.83,27.05 84.58,27.05 84.58,30.99
  pour Top (rank 2, no thermals): 76.96,11.94 76.96,7.87 85.34,7.87 85.34,11.94
  pour Top (no thermals): 77.6,20.95 77.6,17.02 86.74,17.02 86.74,20.95
INA1  (via drill 0.35)
  Top 0.254: U1.43 56.36,60.24 62.77,60.24 67.8,55.21 v67.8,48.22 | v58.67,37.59 58.74,37.53 U$1.4
  Bottom 0.254: v67.8,48.22 67.44,48.22 67.2,47.98 60.96,47.98 60.48,47.5 60.48,45.57 58.82,43.92 58.82,37.74 v58.67,37.59
INA2  (via drill 0.35)
  Top 0.254: U1.41 62.55,59.3 66.04,55.81 v66.04,54.48 | v73.91,51.18 72.91,50.18 72.91,44.26 70.92,42.27 60.68,42.27 v60.33,41.91 | v58.8,18.41 58.86,18.48 U$2.4
  Bottom 0.254: v66.04,54.48 67.44,53.09 72.52,53.09 73.91,51.69 v73.91,51.18 | v60.33,41.91 60.33,19.94 v58.8,18.41
INB1  (via drill 0.35)
  Top 0.254: U$1.10 57.88,31.53 56.64,32.77 56.64,42.01 v56.49,42.16 | v66.93,48.64 66.93,55.5 62.61,59.82 62.6,59.8 U1.42
  Bottom 0.254: v56.49,42.16 60.07,45.74 60.07,48.39 60.33,48.64 v66.93,48.64
INB2  (via drill 0.35)
  Top 0.254: U1.40 62.47,58.8 64.9,56.38 v64.9,53.34 | v72.26,50.82 72.26,44.45 70.48,42.67 59.8,42.67 v59.48,42.35 | v58.04,12.45 60.44,12.45 U$2.10
  Bottom 0.254: v64.9,53.34 65.56,52.68 71.4,52.68 72.26,51.82 v72.26,50.82 | v59.48,42.35 59.8,42.67 60.58,42.67 60.98,42.27 60.98,41.64 60.96,41.62 60.96,12.83 60.58,12.45 v58.04,12.45
MISO
  Top 0.254: JP12.2 83.31,64.52 78.36,69.47 78.36,69.98 | 78.36,69.98 78.36,78.61 80.39,80.64 JP5.2 | U1.56 50.8,68.7 52.07,69.98 78.36,69.98
N$1
  Top 0.305: U1.13 43.34,56.8 42.8,56.26 FB1.2 40.61,55.33 C1.1
N$2
  Top 0.305: U1.5 35.33,60.8 34.26,61.88 X1.P$1 34.26,65.88 C2.1
N$3
  Top 0.254: R1.1 51.69,72.52 48.8,69.62 U1.60
N$4
  Top 0.508: J5.4 89.05,66.04 JP3.1 JP2.1
N$6
  Top 0.254: LED1.C 25.43,91.6 R2.2
N$7  (via drill 0.35)
  Top 0.254: v58.8,15.49 58.82,15.48 U$2.7 | R7.1 56.26,43.37 54.99,42.1 v54.99,37.72
  Bottom 0.254: v54.99,37.72 54.99,19.3 v58.8,15.49
N$8  (via drill 0.35)
  Top 0.254: R10.1 33.4,51.25 R11.1 33.47,48.83 v33.78,48.51 | U$1.8 v58.55,33.53
  Bottom 0.254: v58.55,33.53 56.77,35.31 56.77,38.23 51.56,43.43 38.86,43.43 v33.78,48.51
N$9
  Top 0.254: R4.1 62.83,43.71 58.32,43.71 57.56,42.95 57.56,34.9 57.93,34.53 U$1.7
N$10
  Top 0.254: R6.1 66.17,43.74 65.74,43.31 58.49,43.31 57.96,42.78 57.96,36.78 58.21,36.53 U$1.5
  Top 0.508: R6.1 R12.2
N$11
  Top 0.254: R13.2 58.86,44.45 57.91,44.45 57.15,43.69 57.15,33.66 58.29,32.51 60.33,32.51 U$1.9
  Top 0.508: R13.2 R5.1
N$12  (via drill 0.35)
  Top 0.254: v55.75,35.94 54.99,36.7 51.44,36.7 48.01,40.13 R16.1 R8.1 | v58.29,17.53 60.42,17.53 U$2.5
  Bottom 0.254: v55.75,35.94 55.75,19.43 57.66,17.53 v58.29,17.53
N$13  (via drill 0.35)
  Top 0.254: R9.1 53.47,43.56 v53.47,37.72 | v57.78,13.59 57.9,13.48 U$2.9
  Top 0.508: R17.1 R9.1
  Bottom 0.254: v53.47,37.72 53.47,17.91 v57.78,13.59
N$14  (via drill 0.35)
  Top 0.254: R15.1 38.17,53.47 R14.1 38.17,47.3 47.75,37.72 v49.4,37.72 | v54.74,14.48 58.08,14.48 U$2.8
  Bottom 0.254: v49.4,37.72 52.96,34.16 52.96,16.26 v54.74,14.48
N$15  (via drill 0.35)
  Top 0.254: U$4.1 55.12,20.58 57.02,22.48 v57.02,24.26 | v57.02,30.48 57.07,30.53 U$1.11
  Bottom 0.254: v57.02,24.26 v57.02,30.48
N$16
  Top 0.305: U1.6 31.52,60.3 30.26,61.56 X1.P$2 30.26,66.14 C3.1
N$17
  Top 0.254: U$3.1 49.72,11.48 U$2.11
N$18
  Top 0.508: J4.4 95.12,76.07 JP4.1 JP6.1
N$19
  Top 0.254: JP9.1 85.42,83.64 | 85.42,83.64 86.51,82.55 J4.2 | JP10.1 85.42,85.17 85.42,83.64
N$21
  Top 0.254: J4.3 95.63,79.12 JP7.1 85.24,80.39 | JP5.1 85.24,80.39 | JP8.1 85.24,80.39
N$23
  Top 0.254: J5.3 96.01,62.99 JP11.1 JP12.1 JP13.1
N$24
  Top 0.254: J5.2 95,59.44 86.61,59.44 | 86.61,59.44 JP15.1 | JP14.1 86.61,60.98 86.61,59.44
NODE1  (via drill 0.35)
  Top 0.254: U1.27 51.8,51.56 v51.54,51.31 | v60.2,82.42 59.69,82.93 U$6.1
  Bottom 0.254: v51.54,51.31 51.94,51.71 51.94,54.81 57.28,60.15 65.66,60.15 66.46,60.95 66.46,76.54 60.58,82.42 v60.2,82.42
NODE2  (via drill 0.35)
  Top 0.254: U$6.2 62.36,85.55 62.36,83.31 64.01,81.66 v64.14,81.66 | v52.45,51.05 52.45,51.73 52.36,51.81 52.36,53.24 U1.28
  Bottom 0.254: v64.14,81.66 66.87,78.93 66.87,60.78 65.83,59.74 57.45,59.74 52.43,54.72 52.43,51.75 52.45,51.73 v52.45,51.05
NODE3  (via drill 0.35)
  Top 0.254: U1.29 52.8,51.96 v53.68,51.07 | v65.02,82.42 64.77,82.68 U$6.3
  Bottom 0.254: v53.68,51.07 52.83,51.92 52.83,54.55 57.62,59.33 66,59.33 67.28,60.61 67.28,80.17 v65.02,82.42
NODE4  (via drill 0.35)
  Top 0.254: U1.30 53.3,52.6 v54.59,51.31 | v67.56,82.42 67.56,85.42 U$6.4
  Bottom 0.254: v54.59,51.31 53.34,52.55 53.34,54.48 57.78,58.93 66.17,58.93 67.69,60.45 67.69,82.3 v67.56,82.42
OUTA1
  Top 0.152: U$1.OUTA@1 U$1.1 U$1.30 73.34,38.28 U$1.OUTA 75.06,35.56 77.31,35.56 U$1.25
  pour Top (rank 3, no thermals): 75.95,41.02 75.95,35.05 97.92,35.05 97.92,42.04 75.95,42.04
OUTA2
  Top 0.152: U$2.1 U$2.OUTA@1 U$2.30
  pour Top (rank 2, no thermals): 76.2,16 90.93,16 92.33,17.4 93.22,18.29 98.04,18.29 98.42,18.67 98.42,23.37 98.3,23.5 85.09,23.5 76.33,23.5 75.18,22.35 75.18,16.38 75.56,16
OUTB1  (1 unrouted)
  Top 0.508: U$1.16 69.47,26.53 | 66.55,26.53 67.06,26.53 | 67.06,26.53 69.47,26.53 | 69.47,26.53 69.96,26.53 73.15,29.72 | U$1.15 66.55,26.53 | 66.55,26.53 67.06,26.53 | 67.06,26.53 69.47,26.53 | U$1.15 66.55,26.53 | U$1.15 67.06,26.53
  pour Top (rank 2, no thermals): 81.03,34.29 97.54,34.29 97.54,26.04 75.69,26.04 75.69,31.88 81.03,31.88
OUTB2
  Top 0.152: U$2.OUTB@1 U$2.15 U$2.16
  pour Top (rank 3, no thermals): 75.31,12.83 89.41,12.83 93.73,17.14 97.92,17.14 97.92,11.68 93.22,6.99 76.07,6.99 75.31,7.75
PA6  (via drill 0.35)
  Top 0.254: JP7.2 v82.17,79.12 | v51.18,49.4 49.3,51.29 U1.22
  Bottom 0.254: v82.17,79.12 84.84,79.12 87.02,76.94 87.02,56.41 80.01,49.4 v51.18,49.4
PA7  (via drill 0.35)
  Top 0.254: U1.23 49.8,51.93 49.91,51.82 51.56,50.16 v53.47,50.16 | v83.69,66.04 JP13.2
  Bottom 0.254: v53.47,50.16 79.88,50.16 86.61,56.9 86.61,65.41 85.98,66.04 v83.69,66.04
PB5
  Top 0.254: U1.57 50.3,69.15 51.59,70.45 75.66,70.45 77.6,72.39 77.6,80.77 80.64,83.82 JP9.2
PB6  (via drill 0.35)
  Top 0.254: U1.58 49.8,69.23 51.82,71.25 v70.48,71.25 | v84.84,60.96 85.57,60.96 JP14.2
  Bottom 0.254: v70.48,71.25 71.25,71.25 81.53,60.96 v84.84,60.96
PB8  (via drill 0.35)
  Top 0.254: U1.61 48.36,64.87 48.36,69.77 52.51,73.91 v75.18,73.91 | v80.26,64.01 81.28,62.99 JP11.2
  Bottom 0.254: v75.18,73.91 77.22,71.88 77.22,67.06 v80.26,64.01
PB9  (via drill 0.35)
  Top 0.254: JP8.2 80.64,82.17 v78.99,80.52 | U1.62 47.8,69.89 54.48,76.58 v76.07,76.58
  Bottom 0.254: v78.99,80.52 76.07,77.6 v76.07,76.58
PC11
  Top 0.254: U1.52 52.8,67.53 53.19,67.92 55.78,67.92 57.53,66.17 74.93,66.17 83.69,57.4 95.5,57.4 J5.1
PC12  (via drill 0.35)
  Top 0.254: U1.53 52.3,67.66 53.59,68.96 68.07,68.96 v68.71,68.33
  Bottom 0.254: v68.71,68.33 68.71,80.52 75.56,87.38 90.68,87.38 92.96,85.09 J4.1
PWM1
  Top 0.254: R4.2 63.75,56.26 61.71,58.3 U1.39
PWM2
  Top 0.254: U1.36 57.37,56.8 57.94,56.24 57.94,54.7 57.32,54.08 57.28,54.08 56.26,53.06 R7.2
RST  (via drill 0.35)
  Top 0.254: U1.7 30.36,59.8 26.29,63.88 26.29,69.47 29.21,72.39 S1.2
  Top 0.508: R3.2 30.92,85.34 C15.1 30.92,81.59 v30.86,81.53 | JP1.10 45.72,74.17 43.95,72.4 36.72,72.4 S1.1 36.58,72.52 v33.15,72.52 31.24,72.52 S1.2
  Bottom 0.508: v30.86,81.53 33.15,79.25 v33.15,72.52
SCK  (via drill 0.35)
  Top 0.254: U1.55 51.3,67.93 52.85,69.49 72.75,69.49 76.58,65.66 77.53,64.71 | JP15.2 82.8,59.44 77.53,64.71 | 77.53,64.71 v79.5,66.67 | v80.77,84.96 81.15,85.34 JP10.2
  Bottom 0.254: v79.5,66.67 80.77,67.94 v80.77,84.96
SWCLK  (via drill 0.35)
  Top 0.254: JP1.4 49.53,74.17 v49.78,73.91 | v54.36,67.18 54.36,64.86 U1.49
  Bottom 0.254: v49.78,73.91 54.36,69.34 v54.36,67.18
SWDIO  (via drill 0.35)
  Top 0.254: U1.46 60.53,61.8 v61.34,62.61 | v51.18,74.42 50.8,74.8 JP1.2
  Bottom 0.254: v61.34,62.61 61.34,65.28 52.2,74.42 v51.18,74.42
VIN  (via drill 0.35)
  Top 0.508: U$2.12 54.04,10.48 v53.98,10.41 | v41.91,10.41 41.95,10.45 U$3.3 | U$4.3 42.55,23.45 v42.55,28.07 | v52.07,28.45 57.15,28.45 58.23,29.53 U$1.12
  Bottom 0.508: v53.98,10.41 v41.91,10.41 | v42.55,28.07 42.93,28.45 v52.07,28.45
  pour Top (no thermals): 2.16,34.42 2.16,8.38 45.72,8.38 45.85,8.51 45.85,26.92 45.34,27.43 13.84,27.43 11.81,29.46 9.14,32.13 9.14,34.42 8.89,34.67 2.54,34.67 2.41,34.67
VOUT  (via drill 0.35)
  Top 0.508: U$1.23 U$1.VCC@1 | U$2.VCC@1 U$2.23 | U$1.13 63.42,28.53 v63.63,28.32 | U$1.3 63.58,38.53 v63.63,38.48
  other vias: 64.64,38.48 65.66,38.48 66.67,38.48 67.69,38.48 68.71,38.48 68.71,37.47 67.69,37.47 66.67,37.47 65.66,37.47 64.64,37.47 63.63,37.47 63.63,36.45 64.64,36.45 65.66,36.45 66.67,36.45 67.69,36.45 68.71,36.45 68.71,35.43 68.71,34.42 67.69,28.32 66.67,28.32 65.66,28.32 64.64,28.32 63.63,35.43 63.63,34.42 63.63,33.4 63.63,32.38 63.63,31.37 63.63,30.35 63.63,29.34 64.64,35.43 65.66,35.43 66.67,35.43 67.69,35.43 67.69,34.42 66.67,34.42 65.66,34.42 64.64,34.42 64.64,33.4 65.66,33.4 66.67,33.4 67.69,33.4 68.71,33.4 68.71,32.38 67.69,32.38 66.67,32.38 65.66,32.38 64.64,32.38 64.64,31.37 65.66,31.37 66.67,31.37 67.69,31.37 68.71,31.37 68.71,28.32 64.64,29.34 65.66,29.34 66.67,29.34 67.69,29.34 68.71,29.34 68.71,30.35 67.69,30.35 64.64,30.35 65.66,30.35 66.67,30.35 63.37,19.81 64.39,19.81 65.41,19.81 66.42,19.81 67.44,19.81 68.45,19.81 68.45,18.8 67.44,18.8 66.42,18.8 65.41,18.8 64.39,18.8 63.37,18.8 63.37,17.78 64.39,17.78 65.41,17.78 66.42,17.78 67.44,17.78 68.45,17.78 68.45,16.76 67.44,16.76 66.42,16.76 65.41,16.76 64.39,16.76 63.37,16.76 63.37,15.75 64.39,15.75 65.41,15.75 66.42,15.75 67.44,15.75 68.45,15.75 68.45,14.73 67.44,14.73 66.42,14.73 65.41,14.73 64.39,14.73 63.37,14.73 63.37,13.72 64.39,13.72 65.41,13.72 66.42,13.72 67.44,13.72 68.45,13.72 63.37,12.7 64.39,12.7 65.41,12.7 66.42,12.7 67.44,12.7 68.45,12.7 63.37,11.68 64.39,11.68 65.41,11.68 66.42,11.68 67.44,11.68 68.45,11.68 68.45,10.67 67.44,10.67 66.42,10.67 65.41,10.67 64.39,10.67 63.37,10.67 63.37,9.65 64.39,9.65 65.41,9.65 66.42,9.65 67.44,9.65 68.45,9.65
  pour Top (no thermals): 17.27,29.21 46.86,29.21 47.12,28.96 47.12,10.16 48.39,8.89 69.98,8.89 69.98,39.12 45.59,39.12 42.04,35.56 16.89,35.56 16.64,35.31 16.64,29.84
  pour Bottom (no thermals): 62.61,38.86 62.61,8.76 68.96,8.76 69.09,8.64 69.09,39.12 62.61,39.12

### Text on the board
tPlace: ID SELECTION | CAN BUS | MINH DANG | BRIDGE THE JUMPER / TO SELECT THE PIN | SCK | PB5 | PC12/CS | PB9 | MISO | PA6 | 5V | 3V3 | 3V3 | 5V | PA7 | MISO | PB8 | PB6 | SCK | PC11/CS | ARM CONTROL | DUAL CHANNEL | SPEAR | - | + | MOTOR1 | - | + | VIN | MOTOR2